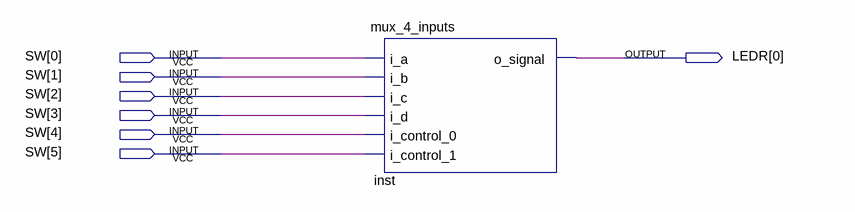
[diagram p0: schematic sheet]
// Quartus schematic Multiplekser.bdf as structural Verilog: 1 symbols, 7 pins
module Multiplekser (
  input  [5:0] SW,
  output [0:0] LEDR
);

  mux_4_inputs inst (
    .i_a(SW[0]), .i_b(SW[1]), .i_c(SW[2]), .i_d(SW[3]), .i_control_0(SW[4]), .i_control_1(SW[5]),
    .o_signal(LEDR[0]));
endmodule
